# EAGLE design MaTouch Devkit_DC Driver V1.2 (EAGLE 6.1)
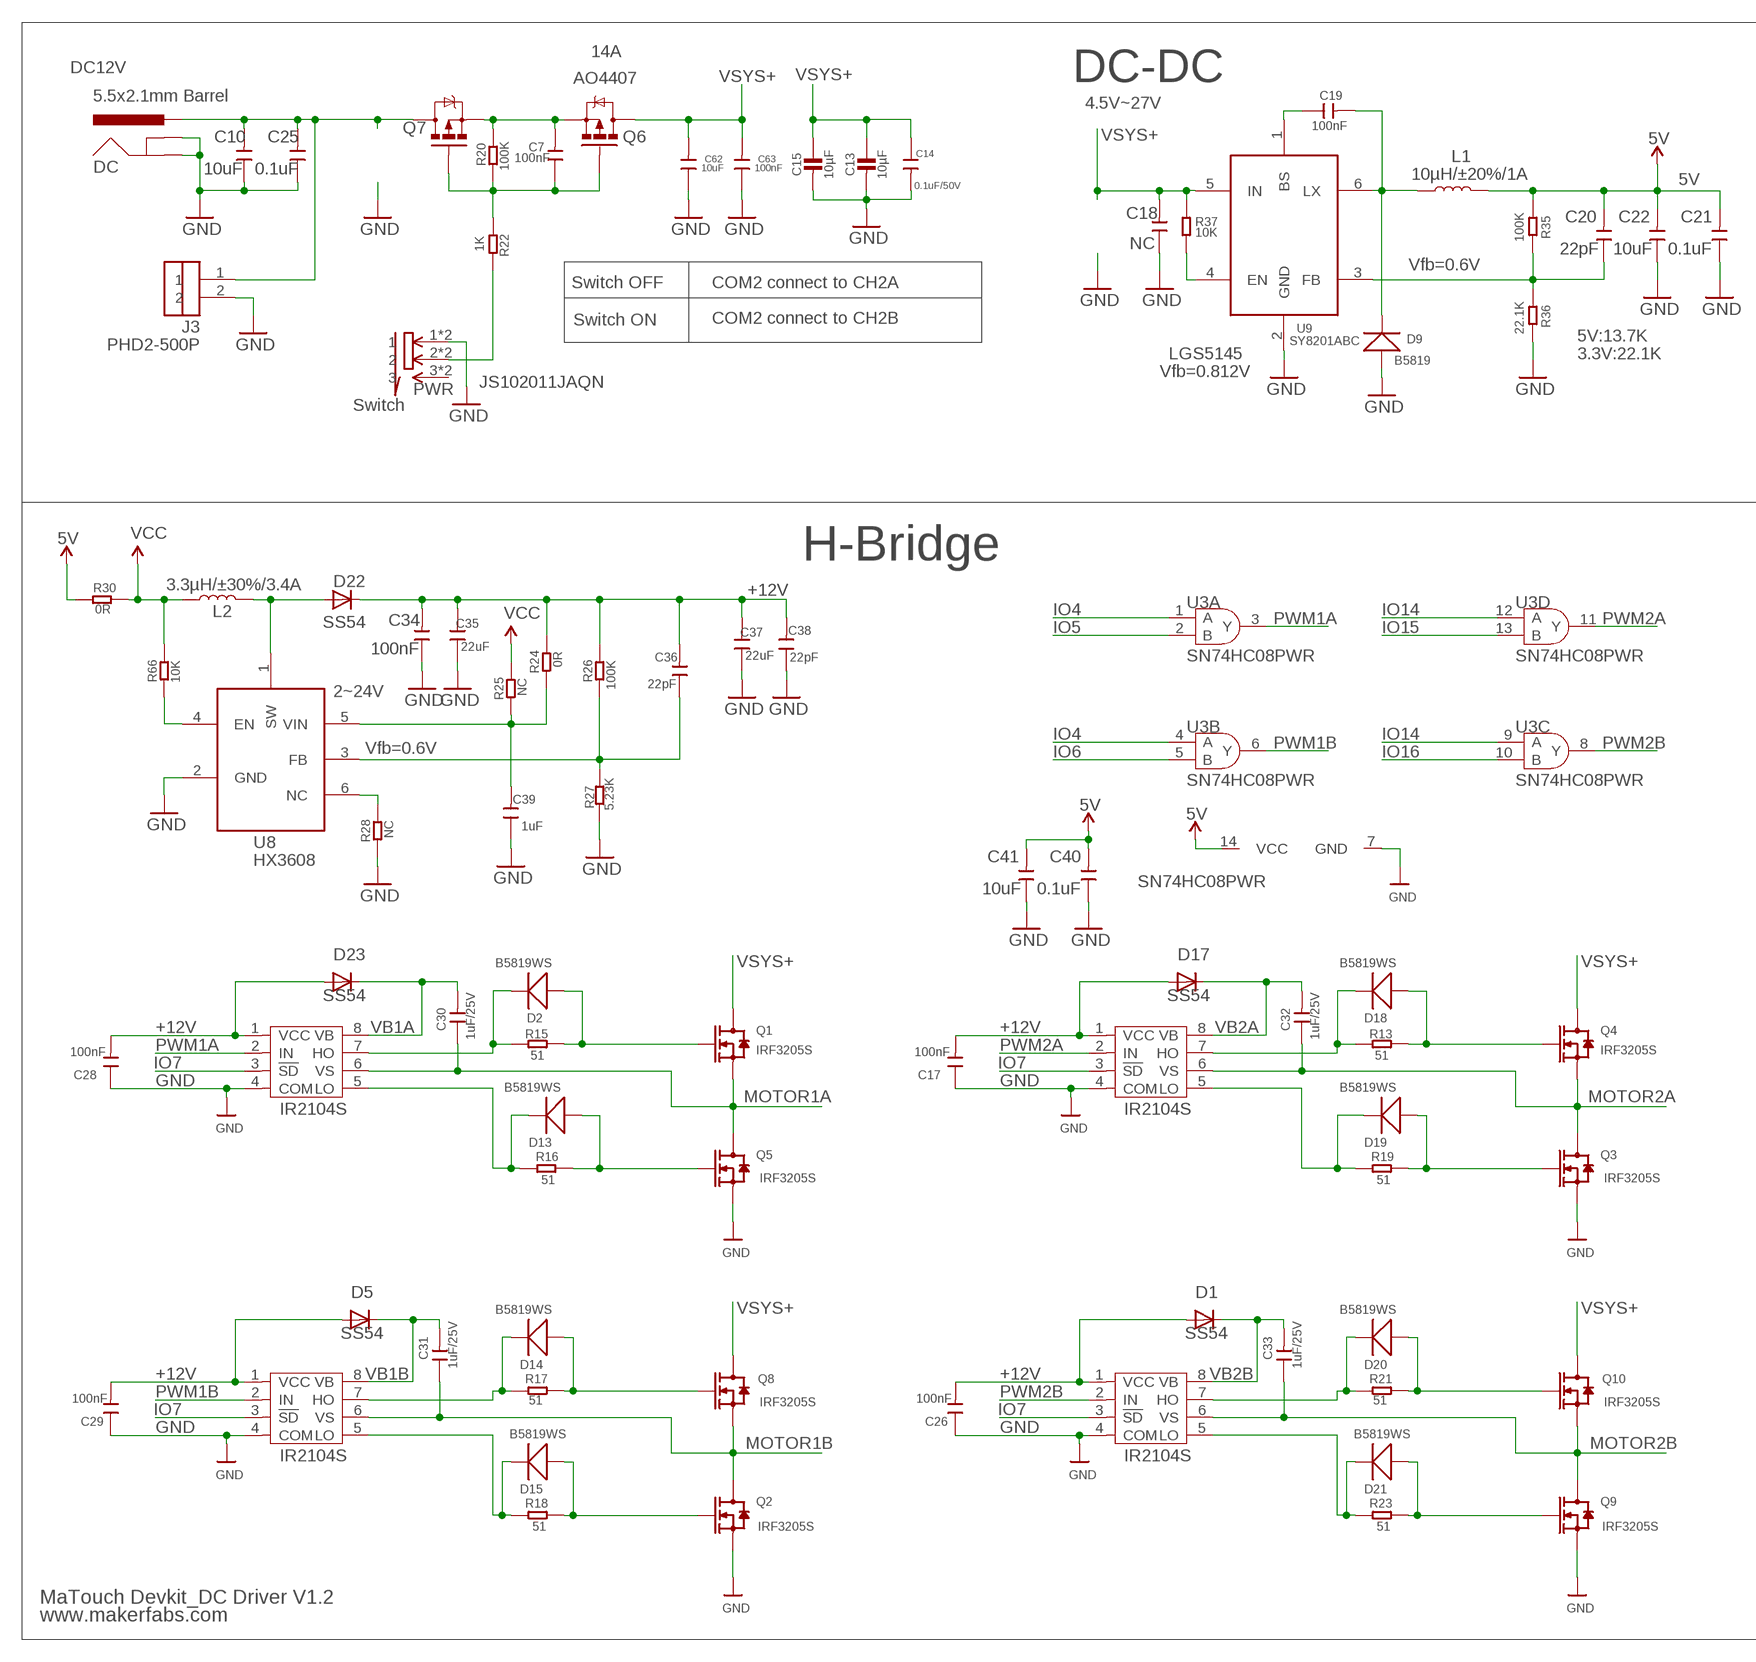
[diagram p0: schematic, sheet 1, part 1 of 2]
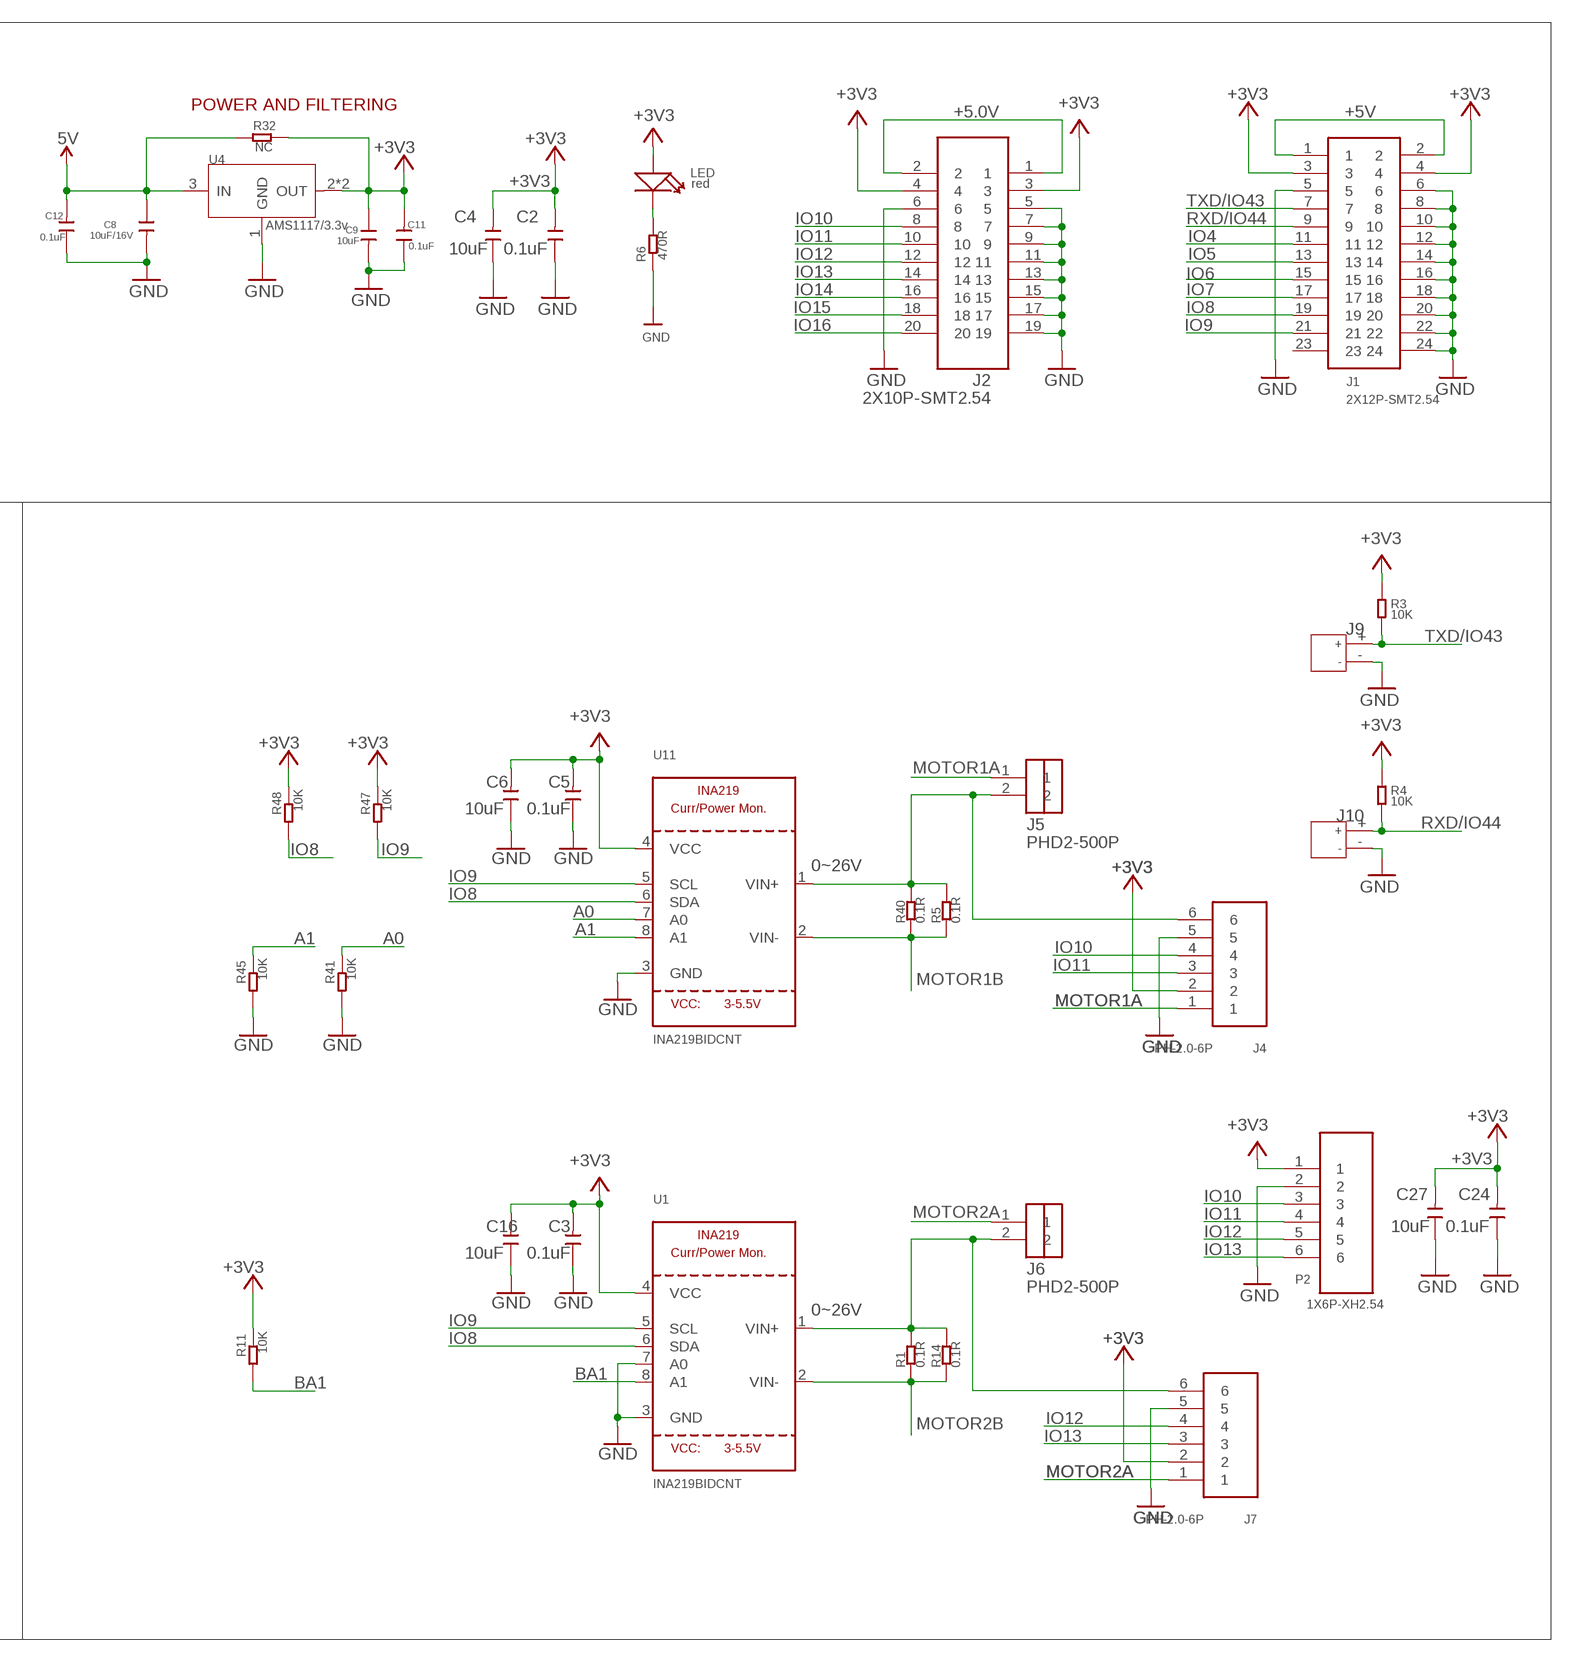
[diagram p1: schematic, sheet 1, part 2 of 2]

## Parts
C2  0.1uF  C-0603  [0603]
C3  0.1uF  C-0603  [0603]
C4  10uF  C-0603  [0603]
C5  0.1uF  C-0603  [0603]
C6  10uF  C-0603  [0603]
C7  100nF  C-0603  [0603]
C8  10uF/16V  C-0603  [0603]
C9  10uF  C-0603  [0603]
C10  10uF  C-0603  [0603]
C11  0.1uF  C-0603  [0603]
C12  0.1uF  C-0603  [0603]
C13  10µF  CAP_CERAMIC0805-NOOUTLINE  [0805-NO]
C14  0.1uF/50V  C-0603  [0603]
C15  10µF  CAP_CERAMIC0805-NOOUTLINE  [0805-NO]
C16  10uF  C-0603  [0603]
C17  100nF  C-0603  [0603]
C18  NC  C-0603  [0603]
C19  100nF  C-0603  [0603]
C20  22pF  C-0603  [0603]
C21  0.1uF  C-0603  [0603]
C22  10uF  C-0603  [0603]
C24  0.1uF  C-0603  [0603]
C25  0.1uF  C-0603  [0603]
C26  100nF  C-0603  [0603]
C27  10uF  C-0603  [0603]
C28  100nF  C-0603  [0603]
C29  100nF  C-0603  [0603]
C30  1uF/25V  C-0805  [0805]
C31  1uF/25V  C-0805  [0805]
C32  1uF/25V  C-0805  [0805]
C33  1uF/25V  C-0805  [0805]
C34  100nF  C-0603  [0603]
C35  22uF  DISCRETE_C-0805  [DISCRETE_C0805]
C36  22pF  C-0603  [0603]
C37  22uF  DISCRETE_C-0805  [DISCRETE_C0805]
C38  22pF  C-0603  [0603]
C39  1uF  C-0603  [0603]
C40  0.1uF  C-0603  [0603]
C41  10uF  C-0603  [0603]
C62  10uF  C-0603  [0603]
C63  100nF  C-0603  [0603]
D1  SS54  DIODE-DO-214AC  [DO-214AC]
D2  B5819WS  D'0805'  [SOD323]
D5  SS54  DIODE-DO-214AC  [DO-214AC]
D9  B5819  D'1206'  [SOD123]
D13  B5819WS  D'0805'  [SOD323]
D14  B5819WS  D'0805'  [SOD323]
D15  B5819WS  D'0805'  [SOD323]
D17  SS54  DIODE-DO-214AC  [DO-214AC]
D18  B5819WS  D'0805'  [SOD323]
D19  B5819WS  D'0805'  [SOD323]
D20  B5819WS  D'0805'  [SOD323]
D21  B5819WS  D'0805'  [SOD323]
D22  SS54  DIODE-DO-214AC  [DO-214AC]
D23  SS54  DIODE-DO-214AC  [DO-214AC]
DC  5.5x2.1mm Barrel  POWER_JACKSMD  [POWER_JACK_SMD]
J1  2X12P-SMT2.54  [2X12P-SMT2.54]
J2  2X10P-SMT2.54  [2X10P-SMT2.54]
J3  PHD2-500P  [OPL_EAGLE_LIBRARY_2P-5.0]
J4  PH-2.0-6P  [PH-2.0-6P]
J5  PHD2-500P  [OPL_EAGLE_LIBRARY_2P-5.0]
J6  PHD2-500P  [OPL_EAGLE_LIBRARY_2P-5.0]
J7  PH-2.0-6P  [PH-2.0-6P]
J9  JACK-JST-2P-PW'2.54/90D'  [JST-2P-2.54-90D]
J10  JACK-JST-2P-PW'2.54/90D'  [JST-2P-2.54-90D]
L1  10µH/±20%/1A  INDUCTOR-SRN6045-33UH  [SRN6045]
L2  3.3µH/±30%/3.4A  INDUCTOR-CR54-3.3UH  [CR54]
LED  red  DISCRETE_LED0603  [DISCRETE_LED-0603]
P2  1X6P-XH2.54  [1*6P-XH2.54]
PWR  JS102011JAQN  [SMD-6-2.5MM]
Q1  IRF3205S  MOSFET-N'IRF3205ZSPBF'  [TO263AB]
Q2  IRF3205S  MOSFET-N'IRF3205ZSPBF'  [TO263AB]
Q3  IRF3205S  MOSFET-N'IRF3205ZSPBF'  [TO263AB]
Q4  IRF3205S  MOSFET-N'IRF3205ZSPBF'  [TO263AB]
Q5  IRF3205S  MOSFET-N'IRF3205ZSPBF'  [TO263AB]
Q6  MOSFET-PCHANNELFDS6675  [SO08]
Q7  MOSFET-PCHANNELFDS6675  [SO08]
Q8  IRF3205S  MOSFET-N'IRF3205ZSPBF'  [TO263AB]
Q9  IRF3205S  MOSFET-N'IRF3205ZSPBF'  [TO263AB]
Q10  IRF3205S  MOSFET-N'IRF3205ZSPBF'  [TO263AB]
R1  0.1R  DISCRETE_R-2512  [DISCRETE_R2512]
R3  10K  R-0603  [R0603]
R4  10K  R-0603  [R0603]
R5  0.1R  DISCRETE_R-2512  [DISCRETE_R2512]
R6  470R  R-0603  [R0603]
R11  10K  R-0603  [R0603]
R13  51  R-0805  [R0805]
R14  0.1R  DISCRETE_R-2512  [DISCRETE_R2512]
R15  51  R-0805  [R0805]
R16  51  R-0805  [R0805]
R17  51  R-0805  [R0805]
R18  51  R-0805  [R0805]
R19  51  R-0805  [R0805]
R20  100K  R-0603  [R0603]
R21  51  R-0805  [R0805]
R22  1K  R-0603  [R0603]
R23  51  R-0805  [R0805]
R24  0R  R-0603  [R0603]
R25  NC  R-0603  [R0603]
R26  100K  R-0603  [R0603]
R27  5.23K  R-0603  [R0603]
R28  NC  R-0603  [R0603]
R30  0R  R-0603  [R0603]
R32  NC  R-0603  [R0603]
R35  100K  R-0603  [R0603]
R36  22.1K  R-0603  [R0603]
R37  10K  R-0603  [R0603]
R40  0.1R  DISCRETE_R-2512  [DISCRETE_R2512]
R41  10K  R-0603  [R0603]
R45  10K  R-0603  [R0603]
R47  10K  R-0603  [R0603]
R48  10K  R-0603  [R0603]
R66  10K  R-0603  [R0603]
U1  INA219BIDCNT  INA219  [SOT23-8]
U2  IR2104S  [SOIC-8]
U3  SN74HC08PWR  SN74HCT08PW  [TSSOP14]
U4  AMS1117/3.3v  LD1117'SOT89'  [SOT89]
U5  IR2104S  [SOIC-8]
U6  IR2104S  [SOIC-8]
U7  IR2104S  [SOIC-8]
U8  HX3608  [SOT-23-6]
U9  SY8201ABC  [SOT-23-6]
U11  INA219BIDCNT  INA219  [SOT23-8]

## Nets
5V: C8.1 C12.2 C20.2 C21.2 C22.2 C40.2 C41.2 L1.2 R30.1 R32.1 R35.1 U3.14(PWR:VCC) U4.3(IN)
+3V3: C2.2 C3.2 C4.2 C5.2 C6.2 C9.1 C11.2 C16.2 C24.2 C27.2 J1.3 J1.4 J2.3 J2.4 J4.2 J7.2 LED.+ P2.1 R3.1 R4.1 R11.2 R32.2 R47.2 R48.2 U1.4(VCC) U4.2(OUT) U4.4(OUT) U11.4(VCC)
+5.0V: J2.1 J2.2
+5V: J1.1 J1.2
+12V: C17.2 C26.2 C28.2 C29.2 C34.2 C35.2 C36.2 C37.2 C38.2 D1.A D5.A D17.A D22.C D23.A R24.2 R26.2 U2.1(VCC) U5.1(VCC) U6.1(VCC) U7.1(VCC)
A0: R41.2 U11.7(A0)
A1: R45.2 U11.8(A1)
BA1: R11.1 U1.8(A1)
ENABLE: R66.1 U8.4(EN)
GND: C2.1 C3.1 C4.1 C5.1 C6.1 C8.2 C9.2 C10.1 C11.1 C12.1 C13.2 C14.2 C15.2 C16.1 C17.1 C18.1 C21.1 C22.1 C24.1 C25.1 C26.1 C27.1 C28.1 C29.1 C34.1 C35.1 C37.1 C38.1 C39.1 C40.1 C41.1 C62.1 C63.1 D9.+ DC.GND(GNDBREAK) DC.P$4(GND) J1.5 J1.6 J1.8 J1.10 J1.12 J1.14 J1.16 J1.18 J1.20 J1.22 J1.24 J2.5 J2.6 J2.7 J2.9 J2.11 J2.13 J2.15 J2.17 J2.19 J3.2 J4.5 J7.5 J9.- J10.- P2.2 PWR.1 PWR.1@1 Q2.3(S) Q3.3(S) Q5.3(S) Q9.3(S) R6.1 R27.1 R28.1 R36.2 R41.1 R45.1 U1.3(GND) U1.7(A0) U2.4(COM) U3.7(PWR:GND) U4.1(GND) U5.4(COM) U6.4(COM) U7.4(COM) U8.2(GND) U9.2(GND) U11.3(GND)
IO4: J1.11 U3.1(A:A) U3.4(B:A)
IO5: J1.13 U3.2(A:B)
IO6: J1.15 U3.5(B:B)
IO7: J1.17 U2.3(!SD) U5.3(!SD) U6.3(!SD) U7.3(!SD)
IO8: J1.19 R48.1 U1.6(SDA) U11.6(SDA)
IO9: J1.21 R47.1 U1.5(SCL) U11.5(SCL)
IO10: J2.8 J4.4 P2.3
IO11: J2.10 J4.3 P2.4
IO12: J2.12 J7.4 P2.5
IO13: J2.14 J7.3 P2.6
IO14: J2.16 U3.9(C:A) U3.12(D:A)
IO15: J2.18 U3.13(D:B)
IO16: J2.20 U3.10(C:B)
MOTOR1A: C30.1 J4.1 J5.1 Q1.3(S) Q5.2(D) U6.6(VS)
MOTOR1B: C31.1 Q2.2(D) Q8.3(S) R5.1 R40.1 U7.6(VS) U11.2(VIN-)
MOTOR2A: C32.1 J6.1 J7.1 Q3.2(D) Q4.3(S) U2.6(VS)
MOTOR2B: C33.1 Q9.2(D) Q10.3(S) R1.1 R14.1 U1.2(VIN-) U5.6(VS)
N$1A: D18.- R13.1 U2.7(HO)
N$2: D19.- R19.1 U2.5(LO)
N$3: J6.2 J7.6 R1.2 R14.2 U1.1(VIN+)
N$4: D18.+ Q4.1(G) R13.2
N$5: LED.- R6.2
N$8: J4.6 J5.2 R5.2 R40.2 U11.1(VIN+)
N$9: C7.1 Q6.4(G) Q7.4(G) R20.2 R22.2
N$10: PWR.2 PWR.2@1 R22.1
N$11A: C10.2 C25.2 DC.VIN0(PWR) J3.1 Q7.5(D) Q7.6(D) Q7.7(D) Q7.8(D)
N$12: D19.+ Q3.1(G) R19.2
N$13: D20.- R21.1 U5.7(HO)
N$14: D2.- R15.1 U6.7(HO)
N$15: D13.- R16.1 U6.5(LO)
N$16: D2.+ Q1.1(G) R15.2
N$17: D13.+ Q5.1(G) R16.2
N$18: D14.- R17.1 U7.7(HO)
N$19: D15.- R18.1 U7.5(LO)
N$20: D14.+ Q8.1(G) R17.2
N$21: D15.+ Q2.1(G) R18.2
N$22: D21.- R23.1 U5.5(LO)
N$23: D20.+ Q10.1(G) R21.2
N$24: D21.+ Q9.1(G) R23.2
N$25: D22.A L2.P$2 U8.1(SW)
N$26: C39.2 R24.1 R25.1 U8.5(VIN)
N$27: C36.1 R26.1 R27.2 U8.3(FB)
N$28: R28.2 U8.6(NC)
N$41: C19.2 D9.- L1.1 U9.6(LX)
N$42: C19.1 U9.1(BS)
N$43: C20.1 R35.2 R36.1 U9.3(FB)
N$44: R37.2 U9.4(EN)
N$49: C7.2 Q6.1(S) Q6.2(S) Q6.3(S) Q7.1(S) Q7.2(S) Q7.3(S) R20.1
PWM1A: U3.3(A:Y) U6.2(IN)
PWM1B: U3.6(B:Y) U7.2(IN)
PWM2A: U2.2(IN) U3.11(D:Y)
PWM2B: U3.8(C:Y) U5.2(IN)
RXD/IO44: J1.9 J10.+ R4.2
TXD/IO43: J1.7 J9.+ R3.2
VB1A: C30.2 D23.C U6.8(VB)
VB1B: C31.2 D5.C U7.8(VB)
VB2A: C32.2 D17.C U2.8(VB)
VB2B: C33.2 D1.C U5.8(VB)
VCC: L2.P$1 R25.2 R30.2 R66.2
VSYS+: C13.1 C14.1 C15.1 C18.2 C62.2 C63.2 Q1.2(D) Q4.2(D) Q6.5(D) Q6.6(D) Q6.7(D) Q6.8(D) Q8.2(D) Q10.2(D) R37.1 U9.5(IN)
Unconnected: J1.23 PWR.3 PWR.3@1

## Notes on the sheet
- 14A
- DC12V
- AO4407 | DC-DC
- 4.5V~27V | POWER AND FILTERING
- Vfb=0.6V
- Switch OFF | COM2 connect to CH2A
- Switch ON | COM2 connect to CH2B
- 5V:13.7K
- LGS5145 | 3.3V:22.1K
- Vfb=0.812V
- Switch
- H-Bridge
- 2~24V
- Vfb=0.6V
- 0~26V
- 0~26V
- MaTouch Devkit_DC Driver V1.2
- www.makerfabs.com

## Library data of the parts
C2-C12 C14 C16-C22 C24-C34 C36 C38-C41 C62 C63 = Discrete:C*: Ceramic Capacitors
C13 C15 = microbuilder:CAP_CERAMIC: Ceramic Capacitors For new designs, use the packages preceded by an '_' character since they are more reliable: The following footprints should be used on most boards: _0402 - Standard footprint for regular board layouts _0603 - Standard footprint for regular board layouts _0805 - Standard footprint for regular board layouts _1206 - Standard footprint for regular board layouts For extremely tight-pitch boards where space is at a premium, the following 'micro-pitch' footprints can be used (smaller pads, no silkscreen outline, etc.): _0402MP - Micro-pitch footprint for very dense/compact boards _0603MP - Micro-pitch footprint for very dense/compact boards _0805MP - Micro-pitch footprint for very dense/compact boards _1206MP - Micro-pitch footprint for very dense/compact boards
C35 C37 = A9G:DISCRETE_C*: Ceramic Capacitors
D1 D5 D17 D22 D23 = diode:DIODE-: DIODE
D2 D9 D13-D15 D18-D21 = Discrete:D*
DC = SparkFun-Connectors:POWER_JACK: Power Jack Connector This is the standard 5.5mm barrel jack for power. The PTH is the most common, proven, reliable, footprint. The Slot footprint only works if the mill layer is transmitted to the PCB fab house so be warned. Here are the connectors we sell at SparkFun: DC Barrel Power Jack/Connector <https://www.sparkfun.com/products/119> (PRT-00119) DC Barrel Power Jack/Connector (SMD) <https://www.sparkfun.com/products/12748> (PRT-12748) DC Barrel Jack Adapter - Breadboard Compatible <https://www.sparkfun.com/products/10811> (PRT-10811) It is used on this SparkFun product (and many, many others): SparkFun RedBoard - Programmed with Arduino <https://www.sparkfun.com/products/12757> (DEV-12757) Also, if you need a mating power supply or connector, please check these out: Wall Adapter Power Supply - 9VDC 650mA <https://www.sparkfun.com/products/298> (TOL-00298) DC Barrel Jack Adapter - Male <https://www.sparkfun.com/products/10287> (PRT-10287); PROD_ID: CONN-08106; SF_ID: PRT-12748
J1 = sale:2X12P-SMT2.54
J2 = sale:2X10P-SMT2.54
J3 J5 J6 = COM-ZYPDN-SO:*PHD2-500P*
J4 J7 = Connector:PH-2.0-6P
J9 J10 = Connector:JACK-JST-2P-PW
L1 = SparkFun-Coils:INDUCTOR: Inductors Resist changes in electrical current. Basically a coil of wire. SparkFun Products: SparkFun Load Cell Amplifier - HX711 <https://www.sparkfun.com/products/13879> IOIO-OTG - V2.2 <https://www.sparkfun.com/products/13613>; PROD_ID: NDUC-11627; VALUE: 33µH/±20%/1.4A
L2 = SparkFun-Coils:INDUCTOR: Inductors Resist changes in electrical current. Basically a coil of wire. SparkFun Products: SparkFun Load Cell Amplifier - HX711 <https://www.sparkfun.com/products/13879> IOIO-OTG - V2.2 <https://www.sparkfun.com/products/13613>; PROD_ID: NDUC-11157
LED = A9G:DISCRETE_LED*
P2 = sale:1X6P-XH2.54
PWR = sale:JS102011JAQN
Q1-Q5 Q8-Q10 = template:MOSFET-N*: IRLL014: http://www.vishay.com/docs/91319/sihll014.pdf
Q6 Q7 = User-Submitted:MOSFET-PCHANNEL: Generic PMOSFET IRLML2244 - TRANS-11153 (SOT-23 -20V -4.3A) (1.Gate 2.Source 3.Drain) FQP27P06 - COM-10349 <http://www.sparkfun.com/products/10349> (TO-220 -60V -27A) (1.Gate 2.Source 3.Drain)
R1 R5 R14 R40 = A9G:DISCRETE_R*
R3 R4 R6 R11 R13 R15-R28 R30 R32 R35-R37 R41 R45 R47 R48 R66 = Discrete:R*
U1 U11 = microbuilder:INA219: INA219 - I2C Current/Power Monitor Voltage Range: 0-26V Accuracy: 0.5% Temperature: -40°C - 125°C
U2 U5-U7 = IC-dwin:IR2104S: HALF-BRIDGE DRIVER
U3 = template:SN74HCT08: Quadruple 2-Input Positive-AND Gates
U4 = IC:LD1117: Low Drop Fixed And Adjustable Positive Voltage Regulators http://www.datasheetcatalog.org/datasheet/SGSThomsonMicroelectronics/mXuqtqv.pdf
U8 = self:HX3608
U9 = self:SY8201ABC

## Net classes
0 default: width 0.203 mm, drill 0.305 mm, clearance 0.152 mm

## Board
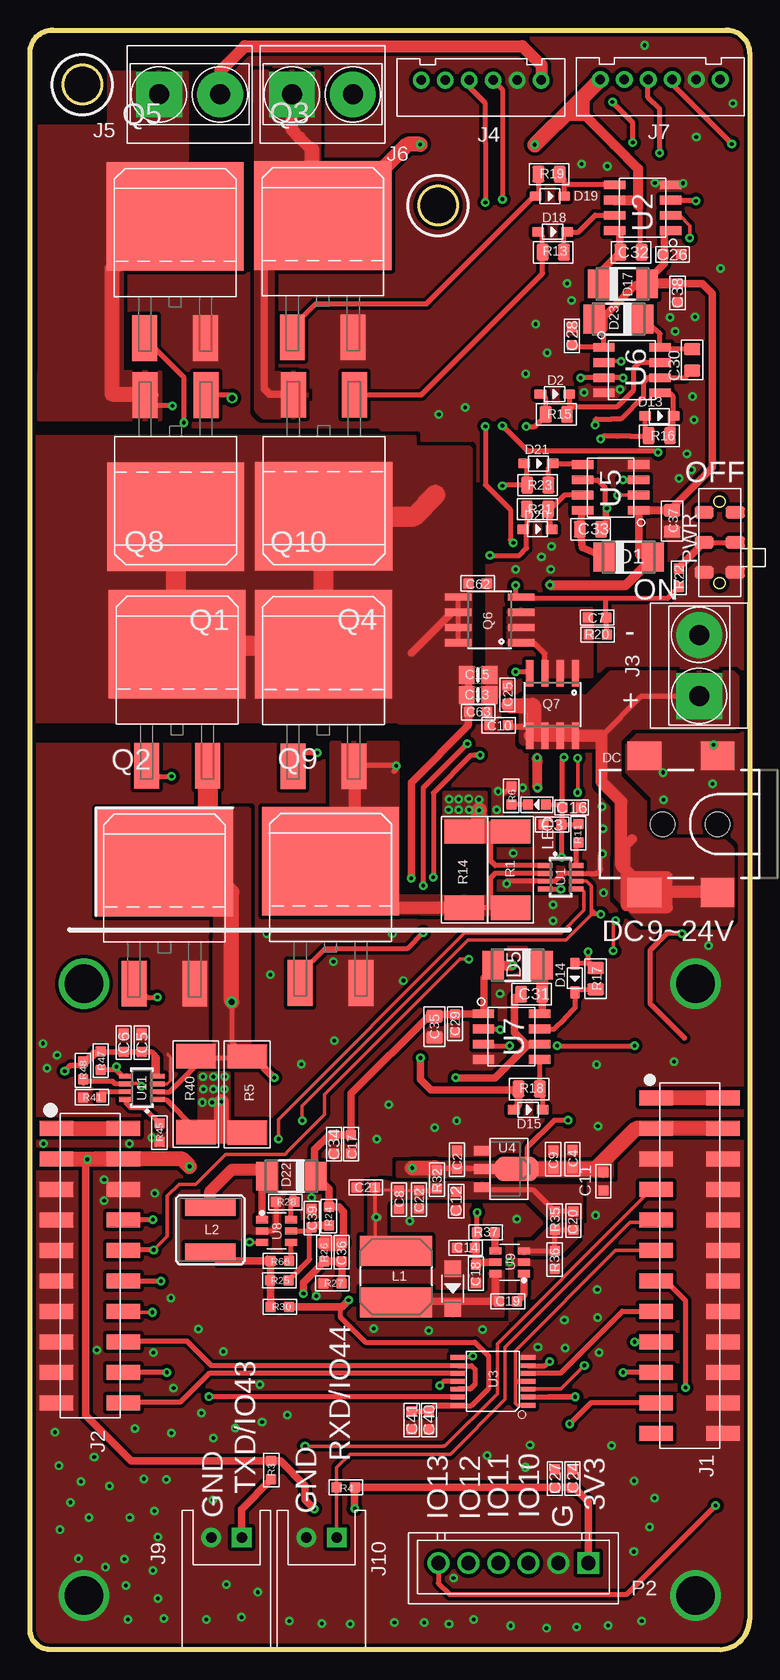
[diagram p2: board, top side]
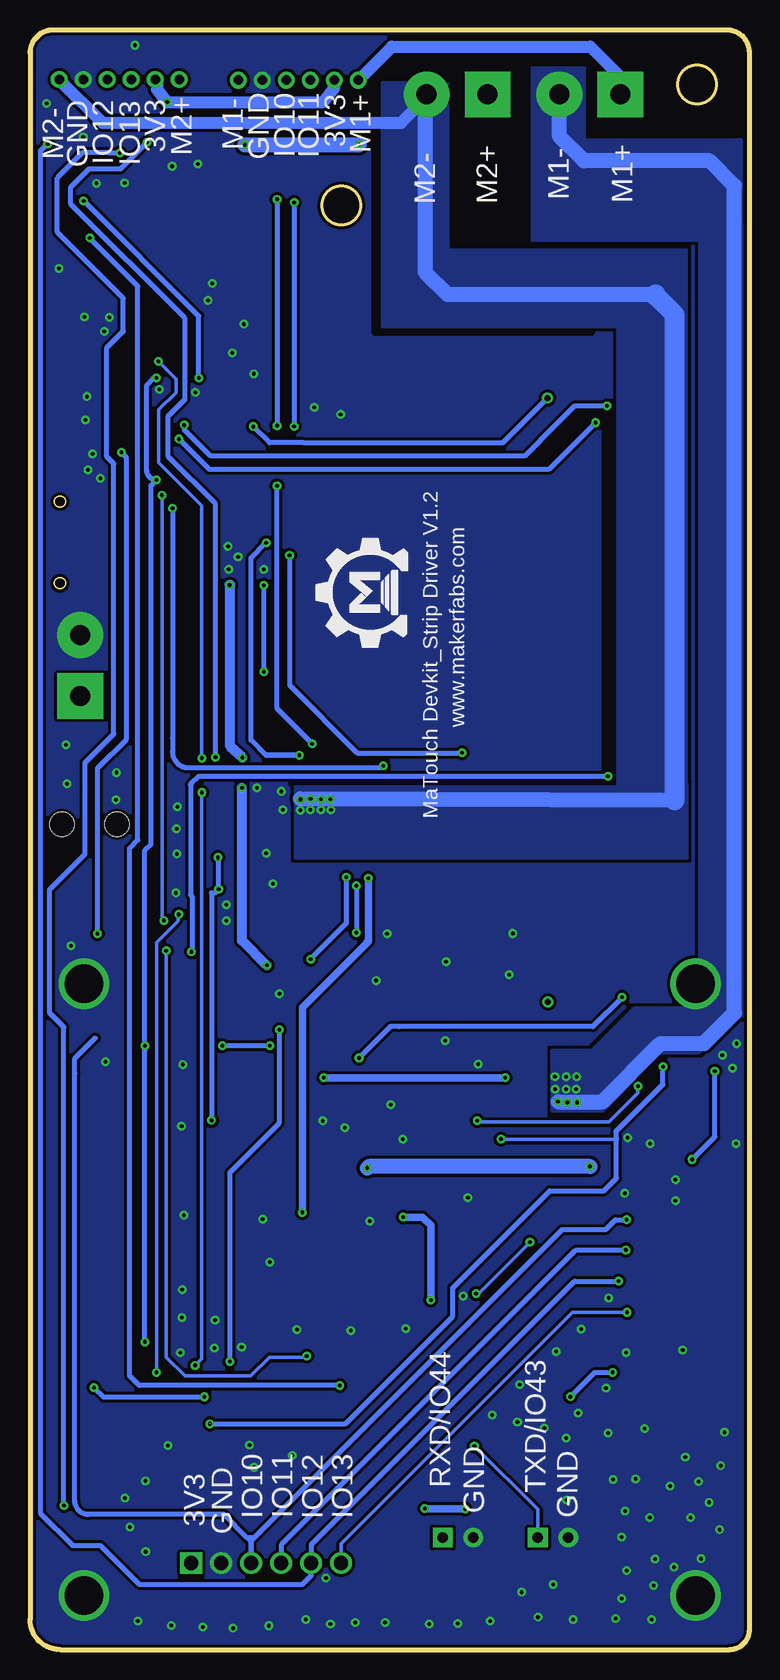
[diagram p3: board, bottom side, seen from below]

Size 60 x 135 mm. Coordinates in mm from the lower left corner, seen from the top.
Outline: 57.5,0 1.66,0 arc-90 0,1.66 0,133.09 arc-90 1.91,135 58.06,135 arc-90 60,133.06 60,2.5 arc-90 57.5,0
Outline: circle at 4.36,130.45 radius 1.6
Outline: circle at 34.02,120.37 radius 1.6
Copper layers (1*16): Top 0.035mm / dielectric 1.5mm / Bottom 0.035mm
Design rules: minimum track width 10mil, minimum drill 10mil, track to track 8mil, track to pad 8mil, pad to pad 8mil, via to via 8mil, smd to smd 0mil, copper to edge 10mil, drill to drill 8mil, minimum pad ring 10mil, minimum via ring 8mil, stop-mask expansion 4mil, vias tented up to drill 100mil, thermal gap 0mil
tRestrict: area 37.1,77.4 to 37.6,97; area 0.2,75.9 to 30.9,77; area 0.3,101.4 to 11.4,102.4; area 11,101.4 to 28.9,101.5
bRestrict: area 11.2,72.9 to 12.1,103; area 13.2,109.7 to 31.3,110; area 30.9,109.7 to 31.3,126.7; area 11.1,72.1 to 38.2,72.5

### Footprints (pad centres in the part's own frame; a part is rotated, then mirrored left to right if it is on the bottom)
0603 = smd 0.889 x 0.889: 1 -0.762,0; 2 0.762,0
0805-NO = smd 1.3 x 1.5: 1 -0.95,0; 2 0.95,0
0805 = smd 1.016 x 1.397: 1 -0.889,0; 2 0.889,0
DISCRETE_C0805 = smd 1.016 x 1.397: 1 -0.889,0; 2 0.889,0
DO-214AC = smd 1.8 x 2.4: A 2.025,0; C -2.025,0
SOD323 = smd 1 x 0.8: + -1.2,0; - 1.2,0
SOD123 = smd 1.397 x 1.397: + -1.651,0; - 1.651,0
POWER_JACK_SMD = smd 2.8 x 2.4: GND 0,-5.7; P$4 6.1,-5.7; VIN0 0,5.7; VIN1 6.1,5.7 | hole 2.032: 0,0; 4.572,0
2X12P-SMT2.54 = smd 1.27 x 2.8: 1 -13.97,-2.8; 2 -13.97,2.8; 3 -11.43,-2.8; 4 -11.43,2.8; 5 -8.89,-2.8; 6 -8.89,2.8; 7 -6.35,-2.8; 8 -6.35,2.8; 9 -3.81,-2.8; 10 -3.81,2.8; 11 -1.27,-2.8; 12 -1.27,2.8; 13 1.27,-2.8; 14 1.27,2.8; 15 3.81,-2.8; 16 3.81,2.8; 17 6.35,-2.8; 18 6.35,2.8; 19 8.89,-2.8; 20 8.89,2.8; 21 11.43,-2.8; 22 11.43,2.8; 23 13.97,-2.8; 24 13.97,2.8
2X10P-SMT2.54 = smd 1.27 x 2.8: 1 -11.43,-2.8; 2 -11.43,2.8; 3 -8.89,-2.8; 4 -8.89,2.8; 5 -6.35,-2.8; 6 -6.35,2.8; 7 -3.81,-2.8; 8 -3.81,2.8; 9 -1.27,-2.8; 10 -1.27,2.8; 11 1.27,-2.8; 12 1.27,2.8; 13 3.81,-2.8; 14 3.81,2.8; 15 6.35,-2.8; 16 6.35,2.8; 17 8.89,-2.8; 18 8.89,2.8; 19 11.43,-2.8; 20 11.43,2.8
OPL_EAGLE_LIBRARY_2P-5.0 = drill 1.668 pad 3.81 square: 1 -2.54,0 | drill 1.668 pad 3.81: 2 2.54,0
PH-2.0-6P = drill 0.8 pad 1.4: 1 -5,0; 2 -3,0; 3 -1,0; 4 1,0; 5 3,0; 6 5,0
JST-2P-2.54-90D = drill 0.889 pad 1.651 square: + 2.286,-1.27 | drill 0.889 pad 1.651: - 2.286,1.27
SRN6045 = smd 2.5 x 6: 1 -2.175,0; 2 2.125,0
CR54 = smd 4.2 x 1.4: P$1 0,1.85; P$2 0,-1.85
DISCRETE_LED-0603 = smd 0.889 x 0.889: + -0.762,0; - 0.762,0
1*6P-XH2.54 = drill 1.2 square: 1 -6.25,0 | drill 1.2: 2 -3.75,0; 3 -1.25,0; 4 1.25,0; 5 3.75,0; 6 6.25,0
SMD-6-2.5MM = smd 1 x 1.6: 1 -2.5,1.3; 1@1 -2.5,-1.3; 2 0,1.3; 2@1 0,-1.3; 3 2.5,1.3; 3@1 2.5,-1.3
TO263AB = smd 2.08 x 3.8: 1 -2.54,-6.4; 3 2.54,-6.4 | smd 11.43 x 9.05: 2 0,3.75
SO08 = smd 0.61 x 2.21: 1 -1.905,-2.616; 2 -0.635,-2.616; 3 0.635,-2.616; 4 1.905,-2.616; 5 1.905,2.616; 6 0.635,2.616; 7 -0.635,2.616; 8 -1.905,2.616
DISCRETE_R2512 = smd 2.032 x 3.302: 1 -3.175,0; 2 3.175,0
R0603 = smd 0.889 x 0.889: 1 -0.762,0; 2 0.762,0
R0805 = smd 1.016 x 1.397: 1 -0.889,0; 2 0.889,0
SOT23-8 = smd 0.4 x 1.2: 1 -0.975,-1.3; 2 -0.325,-1.3; 3 0.325,-1.3; 4 0.975,-1.3; 5 0.975,1.3; 6 0.325,1.3; 7 -0.325,1.3; 8 -0.975,1.3
SOIC-8 = smd 0.72 x 1.78: 1 -1.905,-2.34; 2 -0.635,-2.34; 3 0.635,-2.34; 4 1.905,-2.34; 5 1.905,2.34; 6 0.635,2.34; 7 -0.635,2.34; 8 -1.905,2.34
TSSOP14 = smd 0.4 x 1.2: 1 -2,-2.925; 2 -1.3,-2.925; 3 -0.65,-2.925; 4 0,-2.925; 5 0.65,-2.925; 6 1.3,-2.925; 7 2,-2.925; 8 2,2.925; 9 1.3,2.925; 10 0.65,2.925; 11 0,2.925; 12 -0.65,2.925; 13 -1.3,2.925; 14 -2,2.925
SOT89 = smd 0.8 x 1.4: 1 -1.524,-1.905; 3 1.524,-1.905 | smd 0.8 x 1.9: 2 0,-1.651 | smd 2.032 x 3.65: 4 0,0.94
SOT-23-6 = smd 1 x 0.6: 1 -1.2,0.95; 2 -1.2,0; 3 -1.2,-0.95; 4 1.2,-0.95; 5 1.2,0; 6 1.2,0.95

### Placement (x,y rotation side)
C2  35.61,40.84 270 top
C3  43.56,68.77 0 top
C4  45.24,40.89 270 top
C5  9.32,50.58 270 top
C6  7.82,50.58 270 top
C7  47.29,86.02 180 top
C8  30.78,37.5 270 top
C9  43.63,40.86 90 top
C10  39.09,77.05 0 top
C11  47.8,39.03 90 top
C12  35.53,37.37 90 top
C13  37.36,79.56 0 top
C14  36.35,33.49 180 top
C15  37.36,81.24 0 top
C16  45.16,70.19 180 top
C17  26.77,42.12 90 top
C18  37.18,31.32 90 top
C19  39.85,29.02 180 top
C20  45.31,35.76 90 top
C21  28.01,38.52 0 top
C22  32.43,37.51 90 top
C24  45.24,14.26 270 top
C25  39.8,79.58 270 top
C26  53.57,116.29 180 top
C27  43.76,14.26 270 top
C28  45.19,109.49 270 top
C29  35.43,52.18 90 top
C30  55.22,107.5 90 top
C31  41.83,54.62 0 top
C32  50.11,116.47 180 top
C33  46.74,93.38 180 top
C34  25.35,42.12 90 top
C35  33.73,51.9 90 top
C36  25.98,33.11 90 top
C37  53.54,94.07 90 top
C38  54,113.09 90 top
C39  23.5,35.95 270 top
C40  33.27,19.11 90 top
C41  31.83,19.11 90 top
C62  37.32,88.87 180 top
C63  37.36,78.13 180 top
D1  49.91,91.07 0 top
D2  43.76,104.63 0 top
D5  40.67,57.03 180 top
D9  35.25,30.09 270 top
D13  52.48,102.83 0 top
D14  45.44,55.97 270 top
D15  41.55,44.99 0 top
D17  49.43,113.83 0 top
D18  43.59,118.17 0 top
D19  43.36,121.14 0 top
D20  42.32,93.38 0 top
D21  42.39,98.87 0 top
D22  21.79,39.46 180 top
D23  49.07,110.91 180 top
DC  57.33,68.8 180 top
J1  55,32 270 top
J2  5,32 270 top
J3  PHD2-500P*  [OPL_EAGLE_LIBRARY_2P-5.0]  55.8,82.03 90 top
J4  37.62,130.82 0 top
J5  PHD2-500P*  [OPL_EAGLE_LIBRARY_2P-5.0]  13.31,129.63 0 top
J6  PHD2-500P*  [OPL_EAGLE_LIBRARY_2P-5.0]  24.38,129.63 0 top
J7  52.55,130.87 0 top
J9  16.38,7.05 90 top
J10  24.31,7.05 90 top
L1  30.53,31.12 90 top
L2  15.04,34.99 180 top
LED  42.27,70.42 180 top
P2  40.31,7.2 180 top
PWR  57.51,92.29 90 top
Q1  12.16,98.17 180 top
Q2  11.21,61.89 0 top
Q3  24.41,115.77 0 top
Q4  24.51,98.2 180 top
Q5  12.12,115.71 0 top
Q6  38.33,85.83 90 top
Q7  43.57,78.78 180 top
Q8  12.28,80.05 0 top
Q9  25.08,61.96 0 top
Q10  24.47,80.04 0 top
R1  40.08,65.01 90 top
R3  20.12,14.95 270 top
R4  26.34,13.52 180 top
R5  18.11,46.26 270 top
R6  40.13,71.18 270 top
R11  45.72,68.03 90 top
R13  43.64,116.47 180 top
R14  36.22,65.01 90 top
R15  43.89,102.96 180 top
R16  52.48,101.18 180 top
R17  47.17,55.92 90 top
R18  41.63,46.72 180 top
R19  43.28,122.97 180 top
R20  47.35,84.59 0 top
R21  42.32,95.06 180 top
R22  54.11,89.34 270 top
R23  42.34,97.06 180 top
R24  24.92,36.13 90 top
R25  20.8,30.77 180 top
R26  24.51,33.11 90 top
R27  25.22,30.52 0 top
R28  21.29,37.3 0 top
R30  20.83,28.56 180 top
R32  33.94,39.18 90 top
R35  43.75,35.75 270 top
R36  43.75,32.49 270 top
R37  38.02,34.77 0 top
R40  13.84,46.29 270 top
R41  5.18,46.04 0 top
R45  10.79,43.09 90 top
R47  5.89,49.08 90 top
R48  4.42,48.27 90 top
R66  20.83,32.4 180 top
U1  44.25,64.38 270 top
U2  51.08,120.18 90 top
U3  38.61,22.36 90 top
U4  39.63,40.06 270 top
U5  48.41,96.86 90 top
U6  50.19,106.64 270 top
U7  40.16,51.09 270 top
U8  20.57,34.89 0 top
U9  40,32.28 180 top
U11  9.32,46.82 90 top
U$2  [MAKERFABS_0.3]  28.57,84 90 bottom

### Tracks (layer width: path | path; a pad name or v marks a point on that pad's centre or on a via)
5V  (via drill 0.3)
  Top 0.254: 28.77,36.16 C21.2 28.77,36.03 28.77,34.31 29.82,33.26 30.52,33.26 L1.2 | 29.13,38.26 C8.1 32.42,38.26 C22.2
  Top 0.406: C20.2 R35.1 41.93,38.34 37.92,38.34 U4.3 | C22.2 33.8,38.27 R32.1 33.93,38.41 | U3.14 33.76,20.36 33.73,20.33 | C41.2 C40.2 33.73,20.33 | 33.73,20.33 36.8,20.33 38.25,21.78 38.25,24.45 37.08,25.62 27.96,25.62 25.88,27.7 25.88,28.51 25.93,28.56
  Top 0.61: R30.1 25.93,28.56 26.01,28.56 v26.57,29.12 | v28.88,36.03 28.91,36.03 28.93,36 28.98,36 29.01,36.03 28.77,36.03
  Bottom 0.61: v26.57,29.12 26.57,35.34 27.25,36.03 v28.88,36.03
  pour Top: 28.24,39 28.24,33.21 29.69,33.21 29.69,37.22 30.12,37.65 41.55,37.65 43.23,35.98 46.02,35.98 46.02,38.64 38.61,38.64 38.35,38.9 30.18,38.9 29.36,39.1 29.36,39
+3V3  (via drill 0.3)
  Top 0.305: 47.62,40.93 47.6,40.93 | 47.6,40.93 47.62,40.93 | 47.62,40.93 47.6,40.93 | 47.62,40.93 47.6,40.93 | 47.6,40.93 47.52,40.93 | 47.52,40.93 47.5,40.93 47.52,40.93 | 47.52,40.93 47.6,40.93
  Top 0.406: C9.1 43.66,40.13 C4.2 45.26,40.11 47.02,40.11 47.12,40.02 | U4.4 U4.2 35.63,40.06 C2.2 34.08,40.08 R32.2 33.71,40.17 | 7.85,49.85 R47.2 5.87,49.82 5.31,49.82 4.39,48.91 R48.2 4.37,48.7 3.38,48.7 3.16,48.49 | 9.88,49.85 10.13,49.85 10.31,49.67 | 10.31,49.67 10.62,49.36 U11.4 | v2.9,48.22 3.16,48.49 | 45.74,68.8 R11.2 45.7,68.77 C3.2 | C6.2 7.85,49.85 | 7.85,49.85 9.88,49.85 | 9.88,49.85 9.86,49.82 C5.2 | C27.2 43.79,13.47 45.26,13.47 C24.2 45.31,13.5 45.34,13.52 | v2.9,48.22 3.16,48.49 | v4.78,40.85 4.81,40.89 4.85,40.89 | 47.12,40.02 47.14,39.99 47.12,40.02 | C11.2 47.68,39.79 47.28,40.18 | 50.53,43.43 50.53,43.41 | 47.6,40.93 47.57,40.91 46.66,39.99 46.53,39.99 46.41,40.12 31.88,40.12 v31.88,40.14 | U1.4 44.11,63.4 44.26,63.4 v44.27,63.38 | v44.86,44.11 43.71,44.11 41.45,41.84 41.45,40.4 41.83,40.02 | C3.2 v44.32,66.03 | C3.2 44.4,68.77 C16.2 | C16.2 44.4,74.26 arc-90 v44.53,74.38 | 44.42,70.34 44.35,70.42 LED.+ 44.2,70.42 44.25,70.37 44.25,70.34 C16.2 | v2.9,48.22 2.9,48.25 3.38,48.73 4.24,48.73 4.39,48.88 4.52,49.01 4.55,49.01 4.6,49.06 4.9,49.06 5.59,49.75 5.64,49.75 5.69,49.8 10.19,49.8 10.31,49.67 | 10.31,49.67 10.31,48.04 10.39,47.97 10.41,47.97 10.49,48.04 | v50.27,125.61 50.27,127.29 v48.56,128.99
  Top 0.61: P2.1 46.56,8.73 46.56,12.3 45.34,13.52 R4.1 27.08,13.5 v27.08,11.75 | v23.7,11.72 22.94,12.48 22.94,13.65 20.88,15.71 R3.1 8.46,15.71 4.65,19.52 4.65,40.8 4.72,40.88 4.75,40.88 v4.78,40.85
  Top 1.27: J1.4 J1.3 50.53,43.43 47.28,40.18 47.12,40.02 41.83,40.02 40.61,40.02 U4.4 | v31.88,40.14 33.71,40.14 33.71,40.15 | 33.71,40.15 33.73,40.17 | 33.71,40.17 33.71,40.15 | J2.3 4.85,40.89 5.38,40.89 | 5.38,40.89 J2.4 | J2.4 7.92,40.89 arc-90 7.92,40.88 J2.4 arc-90 J2.4 | v13.31,40.27 12.69,40.89 5.38,40.89
  Bottom 0.406: v4.78,40.85 2.9,42.73 v2.9,48.22 | v44.86,44.11 44.86,63.08 44.6,63.08 44.27,63.41 | v44.53,74.38 44.53,95.52 48.46,99.45 48.46,102.83 47.07,104.23 47.07,110.96 56.59,120.48 56.59,121.91 55.07,123.43 52.45,123.43 v50.27,125.61 | v48.56,128.99 48.56,129.02 | 48.56,129.02 48.56,129.04 48.64,129.12 | 48.62,128.99 48.59,129.02 48.56,129.02 | v44.27,63.38 44.27,63.41 | 44.27,63.41 44.27,63.44 | 44.27,63.44 44.27,65.97 v44.32,66.03 | 44.27,63.41 44.27,63.44 | 44.27,63.44 44.27,63.41 | v44.32,66.03 44.3,66.03 v44.32,66.03 | v44.32,66.03 44.32,66 44.32,63.46 44.27,63.41
  Bottom 0.61: v23.7,11.72 27.05,11.72 v27.08,11.75
  Bottom 1.016: J7.2 49.4,130.72 49.4,130.03 48.62,128.99 v48.56,128.99 35.56,128.99 34.62,130.19 J4.2
  Bottom 1.27: v13.31,40.27 31.75,40.27 v31.88,40.14
  pour Top: 30.61,39.46 48.59,39.46 48.59,40.6 30.61,40.6
+5.0V
  Top 1.27: J2.1 J2.2
+5V
  Top 1.27: J1.2 J1.1
+12V  (via drill 0.3)
  Top 0.254: 52.96,118.27 52.98,118.25 53.45,118.25 | 53.45,118.25 53.85,118.25 | U2.1 53.45,118.25
  Top 0.305: C35.2 33.73,52.94
  Top 0.406: U2.1 53.65,118.27 | 37.19,53.04 37.24,53 37.26,53 U7.1 | 35.48,53 C29.2 | D23.A 47.85,110.11 U6.1 45.49,108.55 45.31,108.72 C28.2 | C26.2 52.86,116.24 52.86,116.04 52.91,115.99 | 23.29,40.02 23.31,40.03 D22.C | U5.1 50.91,95.11 53.47,95.11 | 38.63,56.78 D5.A | 24.97,42.89 C34.2 | 52.02,91.05 51.99,91.07 D1.A
  Top 0.61: U7.1 37.26,53 | 37.26,53 35.48,53 | 24.59,33.87 C36.2 26.16,34.05 26.16,36.49 25.76,36.89 R24.2 24.92,38.39 23.7,39.61 23.29,40.02 | 33.55,52.94 33.73,52.94 C29.2 | 47.85,110.11 47.85,111.11 50.52,113.78 51.4,113.78 D17.A 51.84,114.22 51.84,114.46 52.91,115.53 52.91,115.99 52.91,118.22 52.96,118.27 | C37.2 U5.1 50.75,91.24 D1.A | 53.47,95.11 56.9,98.54 56.9,113.02 56.06,113.85 C38.2 | 37.26,53 37.31,53.05 37.34,53.07 37.39,53.07 37.44,53.02 37.72,53.02 37.85,53.16 37.85,56 38.63,56.78 | D22.C 23.75,39.53 23.75,41.67 24.97,42.89 C34.2 C17.2 26.77,46.34 33.3,52.87 33.66,52.87 33.68,52.84 C35.2
  Top 0.813: C38.2 52.2,113.85 51.84,114.22 | D5.A v40.26,57.03 | v42.32,71.84 42.32,74.03 v42.29,74.35 | v43.36,88.73 49.71,88.73 52.02,91.05
  Top 1.016: 25.88,33.92 arc-90 25.91,33.95
  Top 1.27: R26.2 24.59,33.87 25.78,33.87 arc90 25.81,33.9 25.86,33.9 arc90 25.88,33.92
  Bottom 0.813: v40.26,57.03 42.32,59.09 v42.32,71.84 | v42.29,74.35 43.31,75.27 43.31,88.66 | 43.31,88.66 43.31,88.76 | 43.31,88.76 43.33,88.73 | 43.33,88.73 v43.36,88.73 | 43.33,88.73 43.31,88.76 | 43.31,88.76 43.33,88.76 43.31,88.73 43.31,88.66
A0
  Top 0.406: U11.7 5.97,46.5 R41.2
A1
  Top 0.406: R45.2 9.5,45.15 8.43,45.15 8.02,45.56 | 8.02,45.56 U11.8 8.02,45.56
BA1
  Top 0.406: U1.8 45.55,67.1 R11.1
ENABLE
  Top 0.406: R66.1 21.77,32.58 U8.4
GND  (via drill 0.3, 3.2)
  Top 0.254: U11.3 11.43,47.15 11.71,47.43 11.71,49.39 11.58,49.52 11.58,49.54 11.51,49.62
  Top 0.406: v39.75,63.83 39.75,64.05 U1.3 43.77,64.05 44.4,64.68 44.42,64.7 U1.7 47.19,64.7 arc90 47.57,65.09 47.57,66.14 arc-90 v47.75,66.32 | U8.2 20.27,34.89 20.57,35.19 20.57,37.58 20.55,37.6 R28.1 | v39.04,71.53 39.71,71.53 R6.1
  other vias: 42.17,110.49 8.75,18.41 14.72,2.49 3.38,12.27 5.57,24.97 4.04,7.57 5.36,16.05 44.79,113.87 15.25,12.47 47.25,48.77 54.77,99.67 22.62,48.79 19.35,18.96 11.8,18.03 47.36,43.64 43.07,1.78 50.37,14.06 45.58,1.88 40.09,1.98 48.2,2.01 34.1,102.94 55.5,4.5 20.03,56.26 38.11,16.18 41.69,17.04 48.5,16.99 30.39,2.26 32.88,2.26 34.94,2.13 36.99,2.49 47.46,24.74 25.31,57.33 4.5,4.5 44.61,25.12 44.56,27.46 17.11,18.46 41.31,15.19 28.92,42.54 21.63,2.39 11.16,2.59 40.6,35.86 31.66,35.71 16.37,5.41 10.68,9.37 2.5,9.98 2.4,15.31 4.91,11 4.25,13.99 18.99,4.77 6.29,6.86 52.08,12.62 51.68,10.21 8.01,5.33 10.25,6.58 58.61,128.88 51.24,133.73 31.14,55.76 24.35,2.16 17.64,2.69 51.02,2.36 26.71,2.13 10.65,4.24 7.89,7.54 39.99,32.28 8.17,2.49 10.38,11.56 53.72,49 55.37,102.49 36.3,103.53 19.73,59.69 30.22,59.66 55.5,55.5 2.26,49.53 53.81,109.88 53.38,111.05 49.21,105.03 45.15,112.44 55.46,111.07 41.34,106.35 43.12,108.1 57.59,115.14 46.01,123.82 55.56,126.08 48.15,123.65 56.92,72.16 35.58,44.07 40.31,66.37 54.13,97.61 55.24,104.44 55.17,98.32 15.28,17.63 23.48,37.67 23.89,29.46 47.18,36.19 47.31,30 25.36,50.75 33.74,43.51 29.91,45.41 42.35,25.22 37.73,26.67 28.66,26.74 33.26,26.59 10.3,24.74 16.12,24.84 11.98,21.79 19.16,22.07 9.49,14.22 11.37,14.17 21.45,19.53 14.29,19.71 2.07,18.11 8.32,11 6.62,13.61 10.4,38.02 14.03,26.72 1.08,50.52 1.41,48.46 11.75,29.31 47.33,27.66 50.36,8.15 41.07,71.83 38.91,70 43.48,91.97 43.43,90.04 42.65,91.08 40.51,90.04 47.7,70.26 47.78,68.43 47.83,63.07 6.18,39.17 6.18,37.41 10.17,42.67 1.13,42.16 8.29,42.16 46.21,104.8 43.64,62.08 43.64,60.76 39.19,54.66 52.81,73.1 57,75.41 54.44,122.22 52.11,122.25 35.32,5.97 52.83,70.84 56.57,58.67
  pour Bottom (isolate 0.254, rank 4): -1.2,-15.8 -1.2,145 80,145 80,-15.8
  pour Top (isolate 0.305, rank 4, no thermals): -0.6,-15.8 -0.6,165 80,165 80,-15.8
IO4
  Top 0.305: U3.1 40.63,20.36 40.46,20.53 40.46,22.08 | 40.46,22.08 40.46,22.11 40.72,22.36 U3.4 | U3.4 41.55,22.36 U3.4 | J1.11 48.83,33.27 40.46,24.9 40.46,22.08 | 40.46,22.08 40.46,22.39 40.49,22.41 41.48,22.41 41.55,22.34
IO5  (via drill 0.3)
  Top 0.406: J1.13 52.2,30.41 53.29,30.41 53.34,30.41 54.66,29.09 v54.66,21.83 | U3.2 43.26,21.06 | 43.26,21.06 v45.47,21.06 | v45.47,21.06 45.47,21.04 | v45.47,21.06 43.26,21.06
  Bottom 0.406: v54.66,21.83 53.87,21.04 45.47,21.04 v45.47,21.06
IO6
  Top 0.406: U3.5 41.54,23.02 44.22,23.02 49.39,28.19 J1.15
IO7  (via drill 0.3)
  Top 0.406: v45.92,106.01 U6.3 v49.45,106.01 | v55.52,120.76 53.47,120.76 U2.3 | J1.17 v50.43,25.65 v50.42,25.64 | v49.45,97.5 U5.3 | U7.3 37.94,50.33 v40,50.33 | v43.97,50.33 v50.42,50.33
  Bottom 0.406: v45.92,106.01 45.92,111.16 v55.52,120.76 | v50.42,25.64 50.42,49.9 | 50.42,49.9 v50.42,50.33 | v50.42,50.33 50.42,66.64 49.91,67.14 49.91,97.04 v49.45,97.5 arc90 50.27,98.31 50.27,105.37 49.63,106.01 v49.45,106.01 | v40,50.33 v43.97,50.33 | v50.42,50.33 50.42,49.9
IO8  (via drill 0.3)
  Top 0.305: U1.6 46.4,64.05 46.81,63.64 46.81,62.62 | v9.28,46.95 9.12,47.18 8.03,47.18 8.02,47.17 U11.6 | 46.81,62.6 46.81,62.62 | 46.81,61.28 46.76,61.22 44.68,59.14 42.34,59.14 36.52,59.14 22.71,45.33 v22.71,44.08 | 46.81,61.28 46.81,61.73 | 46.81,61.73 46.81,62.62 | v47.6,61.28 47.27,61.28 | 47.27,61.28 46.81,61.28 | 46.81,61.73 47.27,61.28
  Top 0.406: U11.6 7.09,47.15 6.88,47.36 4.57,47.36 4.47,47.26 4.47,47.15 R48.1 | J1.19 v49.45,23.11 v49.45,23.1
  Bottom 0.305: v9.28,46.95 9.32,46.39 11.73,43.98 22.61,43.98 v22.71,44.08 | v49.45,23.1 49.45,58.61 49.45,58.94 47.65,60.74 47.65,61.22 v47.6,61.28
IO9  (via drill 0.3)  (1 unrouted)
  Top 0.305: U1.5 45.59,63.36 46.02,63.36 46.2,63.18 46.2,61.63 44.3,59.73 36.25,59.73 20.73,44.21 v20.73,42.56
  Top 0.406: U11.5 8.04,47.81 | 7.21,48.27 7.16,48.32 R47.1 | v7.21,48.58 7.21,48.27 | 7.21,48.27 7.67,47.81 8.04,47.81 | 8.1,47.81 8.04,47.81 | J1.21 46.77,20.57 v45.01,18.81
  Bottom 0.305: v20.73,42.56 20.73,42.51 11.1,42.51
  Bottom 0.406: 11.12,43.19 11.1,43.17 11.1,42.63 11.1,42.51 11.1,39.28 12.14,38.24 16.66,38.24 24.74,30.16 24.74,27.77 33.68,18.83 45,18.83 | 11.12,43.17 11.12,43.19 | 11.12,43.19 7.21,47.1 v7.21,48.58 | v45.01,18.81 45.01,18.83
IO10  (via drill 0.3)  (1 unrouted)
  Top 0.406: v10.24,35.83 7.8,35.83 J2.8 arc90 J2.8 | J4.4 39.4,130.04 v39.4,120.89 | v39.4,102.02 41.48,99.94 50.55,99.94 52.12,99.94 v52.38,99.78 | v54.38,59.68 53.09,59.68 51.69,58.28 51.69,53.83 54.59,50.94
  Bottom 0.406: 41.3,9.33 41.56,9.07 P2.3 | 41.3,9.33 16.56,34.07 15.62,35.01 11.99,35.01 11.18,35.83 v10.24,35.83 | P2.3 | P2.3 41.56,9 41.55,9 41.88,9.33 | 41.88,9.33 43.81,11.26 55.14,11.26 arc90 56.26,12.38 56.26,47.99 56.26,49.26 54.59,50.94 | v39.4,120.89 v39.4,102.02 | 54.59,50.94 54.56,50.96 54.59,50.94 | v52.38,99.78 51.99,99.4 51.99,75.83 54.38,73.44 v54.38,59.68 | 41.3,9.33 41.88,9.33
IO11  (via drill 0.3)
  Top 0.305: v36.6,57.54 35.84,57.54 24.56,46.27 24.56,44.59 21.57,41.59 21.26,41.29 16.31,41.29 13.79,38.77 12.42,38.77 11.46,37.81 11.46,34.43 10.29,33.26 10.29,33.28 v10.31,33.31
  Top 0.406: v10.31,33.31 7.84,33.31 arc90 J2.10 | v37.97,120.64 37.97,125.64 37.97,128.89 36.6,130.26 36.62,130.28 J4.3 | v37.97,101.97 37.97,97.09 40.06,95.01 40.06,92.49 40.31,92.24 v40.31,92.26 | v33.63,64.38 33.63,71.41 36.78,74.56 37.03,74.56 | 37.03,74.56 v37.53,74.56 | v37.53,74.56 v37.54,74.56 | v37.54,74.56 v37.53,74.56 | v37.54,74.56 v37.53,74.56 | v37.54,74.56 v37.53,74.56 | v37.54,74.56 v37.53,74.56 | v37.53,74.56 37.03,74.56 | v37.54,74.56 v37.53,74.56 | v37.54,74.56 v37.53,74.56
  Bottom 0.406: v10.31,33.31 14.47,33.31 16.68,31.1 39.06,8.72 P2.4 39.06,7.15 P2.4 39.09,7.2 | v37.97,120.64 v37.97,101.97 | v33.63,64.38 33.63,60.51 v36.6,57.54 | v40.31,92.26 41.58,90.99 41.58,75.81 40.34,74.56 | 40.34,74.56 38.53,74.56 37.82,74.56 | 37.82,74.56 v37.54,74.56 37.82,74.56 | 37.82,74.56 40.34,74.56 | v37.53,74.56 37.82,74.56
IO12  (via drill 0.3)
  Top 0.406: v10.92,30.7 7.83,30.7 arc-90 J2.12 | J7.4 53.55,130.48 v58.52,125.51
  Bottom 0.406: v10.92,30.7 14.59,30.7 16.57,28.71 36.55,8.73 36.56,8.72 P2.5 36.56,7.22 36.55,7.23 36.55,6.16 37.26,5.45 37.26,5.47 37.29,5.45 50.9,5.45 54.13,8.67 56.44,8.67 59.13,11.36 59.13,71.97 59.13,124.9 v58.52,125.51
IO13  (via drill 0.3)
  Top 0.305: v10.21,28.1 7.87,28.1 arc-90 J2.14 arc90 J2.14
  Top 0.406: v52.5,124.75 52.5,128.41 51.54,129.37 51.54,130.75 51.61,130.82 51.6,130.82 J7.3 | P2.6 34.06,5.52 35,4.58 49.76,4.58 v57.17,12
  Bottom 0.305: 34.06,7.23 34.06,8.83 16.64,26.25 14.78,28.1 v10.21,28.1
  Bottom 0.406: v57.17,12 57.17,51.88 58.37,53.07 58.37,63.33 55.4,66.31 55.4,73.24 55.4,73.92 53.01,76.31 53.01,98.84 53.59,99.43 53.59,108.52 52.22,109.89 52.22,112.64 52.32,112.74 52.3,112.74 57.71,118.15 57.71,122.64 57.71,122.67 55.63,124.75 53.42,124.75 v52.5,124.75 | 34.06,7.23 P2.6
IO14
  Top 0.406: U3.12 35.7,21.73 36.73,21.73 37.11,22.11 37.11,23.38 36.83,23.66 U3.9 15.13,23.66 13.11,25.69 7.84,25.69 J2.16
IO15  (via drill 0.3)
  Top 0.406: U3.13 v14.94,21.06 v14.94,21.07 | v11.4,23.1 v11.39,23.11 J2.18
  Bottom 0.406: v14.94,21.07 12.9,23.1 v11.4,23.1
IO16
  Top 0.406: U3.10 14.93,23.01 12.52,20.61 7.77,20.61 | 7.77,20.61 7.75,20.59 | J2.20 7.77,20.6 7.77,20.61
MOTOR1A  (via drill 0.3)
  Top 0.406: 55.19,106.64 C30.1 54.61,106.01 U6.6 51.56,106.01 51.16,105.6 51.16,104.48 49.25,102.58 48.51,102.58 47.22,102.58 47.14,102.5 v47.14,102.07 | 10.53,104.57 10.49,104.57 | 10.49,104.57 Q1.3 9.63,104.61 | v11.89,103.67 10.36,103.67 arc-90 9.88,104.15 10.08,104.15 arc90 10.49,104.56 10.49,104.57
  Top 1.27: Q5.2 11.22,119.46 6.83,115.07 6.83,104.69 6.86,104.66 9.58,104.66 9.63,104.61
  Bottom 0.406: v11.89,103.67 14.55,103.67 16.18,102.04 18.69,99.53 45,99.53 47.14,101.67 v47.14,102.07
  Bottom 1.016: J4.1 29.82,133.62 13.28,133.62 10.77,131.1 J5.1 10.77,129.47
  pour Top: 6.63,131.46 13.03,131.46 13.03,121.04 6.63,121.04
  pour Top: 10.87,102.6 10.87,106.44 0.76,106.44 0.76,102.6
  pour Top: 0.71,126.99 0.71,102.6 7.75,102.6 7.75,126.99
MOTOR1B  (via drill 0.3, 0.5)
  Top 0.305: 40.41,54.34 40.69,54.62 C31.1
  Top 0.406: U11.2 11.66,46.5 13.99,48.83 13.99,49.31 | 13.99,49.31 R40.1 | 13.99,49.31 17.98,49.31 R5.1 | v16.82,53.99 16.82,50.61 18.06,49.36 18.11,49.41 R5.1 | 18.31,49.47 18.29,49.44 R5.1
  Top 0.61: 40.41,54.34 40.41,51.42 40.59,51.24 41.43,50.41 41.73,50.41 | U7.6 42.45,50.41 41.73,50.41 | 41.73,50.41 41.5,50.41 38.76,47.66 v35.51,47.66 | v20.37,47.66 18.57,49.47 18.31,49.47
  Top 1.27: v16.82,53.99 16.82,63.16 14.45,65.52
  Top 1.676: Q8.3 14.82,65.81 14.45,65.44 13.64,65.44 13.54,65.54 12.93,65.54 12.84,65.64 Q2.2
  Bottom 0.61: v35.51,47.66 v20.37,47.66
  pour Top: 18.26,49.57 18.26,70.01 15.42,70.01 15.39,48.65 18.24,48.65
MOTOR2A  (via drill 0.3)
  Top 0.406: C32.1 50.95,116.39 50.9,116.44 50.9,120.18 50.29,120.79 48.77,120.79 | 48.77,120.79 U2.6 48.77,120.79 | 50.7,121.35 50.7,121.14 50.34,120.79
  Top 0.61: Q4.3 21.93,104.63 19.99,104.63 19.51,105.12 19.51,106.97 19.51,118.35 20.95,118.35 20.95,120.44 23.5,120.44
  Top 0.813: Q3.2 24.41,119.57 | 50.34,120.79 48.77,120.79 | 50.7,120.36 50.7,121.35 50.7,123.46 48.72,125.44 45.42,128.74 45.41,128.74 45.64,128.74 46.28,129.37 46.28,127.88 44.73,127.88
  Top 1.016: 23.5,125.03 22.49,126.03 | 22.49,126.03 21.84,126.68 J6.1 | 22.48,126.02 22.49,126.03
  Top 1.27: 23.5,125.03 23.5,120.44 Q3.2 24.71,119.82 25.86,119.82 31.5,125.46 v32.54,125.46 | J7.1 45.42,128.74 42.12,125.44 v42.09,125.44
  Bottom 1.27: v42.09,125.44 32.56,125.44 v32.54,125.46
  pour Top: 18.85,131.53 24,131.51 24.1,120.99 18.95,121.02
  pour Top: 18.87,115.76 18.87,103.36 19.46,102.78 22.81,102.78 23.06,103.03 23.06,106.36 20.22,106.36 20.22,115.76
MOTOR2B  (via drill 0.3)
  Top 0.406: U1.2 38.78,64.7 38.41,64.32 38.41,62.14 | 38.41,62.14 38.53,62.01 | R1.1 37.82,61.81 37.77,61.86 | 37.77,61.86 38.12,61.86 38.41,62.14 | 37.77,61.86 38.2,61.86 38.28,61.94 | U5.6 47.35,97.5 47.93,96.91 47.93,93.23 C33.1 48.11,93.41 v48.11,95.13 | 27.05,73.57 27.01,73.61 Q10.3 arc-90 27.08,73.57 27.08,73.44 arc90 27.36,73.16 27.38,73.16 27.38,73.67 v30.53,73.67 arc-90 30.33,73.19
  Top 1.016: 27.05,73.57 27.05,67.69 Q9.2 26.58,65.71 30.43,61.86 R14.1
  Bottom 0.406: v48.11,95.13 48.11,75.98 48.11,74.81 arc-98 46.61,73.52 arc17 46.58,73.52 30.45,73.52 arc90 30.53,73.59 v30.53,73.67
  pour Top: 25.2,75.58 30.61,75.58 30.61,68.85 25.2,68.85
  pour Top: 39.52,61.28 29.06,61.38 29.01,62.83 39.55,62.75
N$1A
  Top 0.406: R13.1 44.53,117.91 D18.- 44.79,118.15 44.78,118.15 45.72,118.15 47.14,119.57 48.71,119.57 U2.7
N$2
  Top 0.406: D19.- 44.56,122.08 | 44.56,122.08 44.56,122.59 R19.1 | U2.5 44.56,122.08
N$3  (via drill 0.3)
  Top 0.406: U1.1 38.8,65.35 38.43,65.72 38.43,68.41 R1.2
  Top 1.27: 38.43,68.41 38.02,68.01 38.02,67.78 37.44,68.36 37.44,69.96 37.44,69.99 v37.47,69.96 | v37.47,69.96 37.47,69.94 v37.47,69.96
  Bottom 1.016: J7.6 53.95,127.26 29.06,127.26 26.9,129.42 26.9,129.65 J6.2
  Bottom 1.27: 37.47,70.93 6.25,70.8 | J6.2 27.05,129.5 27.05,114.82 25.2,112.97 7.82,112.97 7.75,112.97 7.72,112.94
  Bottom 1.676: 6.25,70.8 6.25,111.26 7.82,112.84 7.82,112.97
  other vias: 36.63,69.99 37.44,70.85 35.76,70.88 34.95,70.88 34.9,70.01 36.6,70.9 35.76,70.01
  pour Bottom: 25.12,130.59 30.66,130.59 30.66,111.92 25.12,111.92
  pour Bottom: 30.66,110.27 5.23,110.22 5.23,116.65 30.66,116.7
  pour Bottom: 11,70.19 11,116.65 5.28,116.65 5.28,70.19
  pour Bottom: 5.2,72.17 37.9,72.17 37.9,66 5.2,66
  pour Top: 34.5,71.46 38.02,71.46 38.02,68.44 34.5,68.44
N$4
  Top 0.406: D18.+ 42.75,117.81 R13.2 42.77,116.44 42.75,116.42 42.75,114.69 32.66,104.6 Q4.1
N$5
  Top 0.406: LED.- R6.2
N$8  (via drill 0.3, 3.2)
  Top 0.406: U11.1 11.34,45.85 13.69,43.5 | 13.69,43.5 13.84,43.34 R40.2 | 13.79,43.17 R40.2 | R40.2 13.92,43.04 | 13.69,43.5 15.98,43.5 | 42.65,130.69 42.62,130.72 J4.6
  Top 1.016: J5.2 15.88,129.65 15.88,131.61 17.93,133.67 41.05,133.67 42.65,132.07 42.65,130.69
  Top 1.27: 13.79,43.17 14.1,43.47 16.99,43.47 16.99,43.5 17.4,43.09 R5.2 | 15.98,43.5 v15.98,45.66
  Top 1.676: 13.92,43.04 18.01,43.04 18.11,43.14
  Bottom 1.27: v15.98,45.66 12.27,45.66 7.42,50.51 3.81,50.51 1.27,53.05 1.27,122.03 3.33,124.09 13.82,124.09 15.85,126.12 J5.2
  other vias: 4.5,55.5 16.23,47.74 14.43,47.74 15.29,47.74 14.45,46.7 15.29,46.7 16.21,46.7 14.38,45.6 15.19,45.6
  pour Bottom: 1.12,125.82 18.16,125.82 18.16,117.46 0.66,117.46 0.66,125.84 1.17,125.84
  pour Bottom: 0.61,118.78 4.19,118.78 4.19,117.49 4.19,52.79 0.58,52.79 0.58,118.81
  pour Bottom: 13.77,131.86 13.77,124.73 18.11,124.73 18.11,131.86
  pour Bottom: 10.54,50 10.54,46.57 12.24,44.87 16.46,44.87 16.46,49.95 16.46,49.97 16.46,50
  pour Top: 16.64,43.22 16.64,48.04 14.07,48.04 14.07,43.22
  pour Bottom: 0.66,53.43 9.58,53.38 13.18,49.77 4.27,49.82
  pour Bottom: 8.64,50.76 8.64,49.31 11.07,46.87 11.07,50.76
  pour Bottom: 9.02,50.41 9.02,48.32 11.66,48.32 11.66,50.41
N$9  (via drill 0.3)
  Top 0.406: R20.2 C7.1 48.01,86.07 48.01,87.62 | Q7.4 41.57,81.5 v40.49,81.5 | v40.49,88.71 40.49,87.74 40.87,87.74 41.02,87.74 | 41.22,87.74 41.02,87.74 | R22.2 53.15,87.62 48.01,87.62 | 48.01,87.62 42.01,87.62 41.9,87.73 Q6.4 40.95,87.74 41.02,87.74
  Bottom 0.406: v40.49,81.5 v40.49,88.71
N$10
  Top 0.406: 56.31,92.29 PWR.2 56.31,92.29 | 56.31,92.29 58.73,92.29 58.78,92.24 58.78,92.26 PWR.2@1 | 54.15,90.13 54.13,90.11 R22.1
  Top 0.61: PWR.2 54.18,90.26 54.18,90.16 54.15,90.13 54.03,90.13
N$11A
  Top 0.406: Q7.5 Q7.6 | Q7.6 43.97,76.16 | 43.97,76.16 Q7.7 | Q7.7 Q7.8 | Q7.8 47.68,76.16 50.98,79.46 55.78,79.46 J3.1 | Q7.8 Q7.7 | Q7.7 44.2,76.16 | Q7.7 43.97,76.16 | 43.97,76.16 Q7.6 | C10.2 45.21,76.72 45.34,76.85 41.91,76.85 39.8,76.85 39.9,76.85 39.93,76.82 | 39.93,78.69 C25.2
  Top 0.813: 50.22,67.55 49.71,67.04 49.71,61.96 50.29,61.96 50.29,61.89 50.27,61.89
  Top 1.016: 50.27,64.38 50.27,63.16 | 50.27,63.16 50.27,61.89 50.29,61.89 53.11,61.89 53.11,64.38 50.27,64.38 | 50.27,64.38 49.33,65.31 49.33,70.67 47.68,72.33 47.68,76.19 47.65,76.16 Q7.5 | DC.VIN0 57.73,63.16 50.32,63.16 50.27,63.16
  Top 1.27: 39.93,78.69 41.92,78.69 41.99,78.62 41.99,76.92 41.91,76.85
  pour Top: 41.4,79.44 46.48,79.44 48.49,81.44 58.57,81.44 58.95,81.06 58.95,77.08 58.72,76.85 50.14,76.85 48.51,75.22 41.43,75.22 41,75.65 41,79.03
  pour Top: 52.55,67.02 51.28,68.29 51.28,70.57 49.15,72.71 49.15,76.97 47.37,76.97 47.37,72.2 48.9,70.67 48.9,65.37 52.55,65.37
  pour Top: 50.52,67.45 48.84,65.77 48.84,62.8 51.1,60.54 58.06,60.54 58.55,61.02 58.55,66.71 57.81,67.45
N$12
  Top 0.406: R19.2 42.39,121.32 42.19,121.12 42.18,121.12 D19.+ | Q3.1 21.88,110.25 23.8,112.18 33.07,112.18 42.06,121.17 42.09,121.14 D19.+ | D19.+
N$13
  Top 0.406: U5.7 44.55,96.23 43.28,94.96 43.28,93.62 D20.- 43.48,93.38 43.41,93.46 43.41,94.86 R21.1
N$14
  Top 0.406: U6.7 50.8,107.28 50.29,106.77 50.29,104.94 48.92,103.57 46.92,103.57 45.36,103.57 arc90 44.91,103.11 44.78,102.98 R15.1 arc90 44.96,103.14 D2.-
N$15
  Top 0.406: U6.5 53.34,104.74 53.59,104.48 53.59,102.81 53.62,102.78 53.62,101.13 R16.1 53.39,102.55 D13.-
N$16  (via drill 0.3, 0.5)
  Top 0.406: v16.84,104.33 16.6,104.57 Q1.1 | D2.+ arc-90 43,104.2 R15.2 43.05,102.91 43.05,102.88 42.11,101.94 v41.38,101.94
  Bottom 0.406: v16.84,104.33 20.57,100.59 37.19,100.59 40.03,100.59 v41.38,101.94
N$17  (via drill 0.3)
  Top 0.406: D13.+ 51.28,101.24 R16.2 51.59,100.93 51.59,101.2 51.54,101.15 51.56,101.13 50.09,101.13 48.95,101.13 47.8,101.13 v47.57,100.9 | Q5.1 12.83,106.06 v12.83,102.27
  Bottom 0.406: v12.83,102.27 16.74,98.36 45.03,98.36 46.2,99.53 v47.57,100.9
N$18
  Top 0.406: U7.7 43.69,51.73 44.63,52.67 45.47,53.5 45.47,54.77 D14.- | D14.- | D14.- 45.7,55.03 R17.1
N$19
  Top 0.406: 42.52,49.24 R18.1 42.75,46.49 D15.- | 42.52,49.24 42.49,49.26 | 42.52,49.24 42.5,49.21 U7.5
N$20  (via drill 0.3)
  Top 0.406: R17.2 46.81,57.17 D14.+ 45.47,57.17 45.47,57.16 45.49,57.16 45.49,57.19 46.51,57.19 46.51,57.16 46.53,57.16 v46.53,58.15 | Q8.1 9.74,73.53 10.49,72.78 v11.81,72.78
  Bottom 0.406: v11.81,72.78 45.82,72.78 45.95,72.78 46.58,72.15 | 46.48,62.75 46.48,58.2 v46.53,58.15 | 46.58,72.15 46.63,72.1 | 46.63,62.9 46.53,62.8 | 46.53,62.8 46.48,62.75 | 46.48,62.75 46.48,62.78 | 46.48,62.78 46.51,62.8 | 46.48,62.75 46.48,62.78 | 46.48,62.78 46.51,62.78 46.53,62.8 | 46.53,62.8 46.51,62.8 | 46.51,62.8 46.56,62.85 46.56,72.12 46.58,72.15
N$21  (via drill 0.3)
  Top 0.406: R18.2 40.35,46.34 40.35,46.41 40.51,46.57 40.44,46.65 | Q2.1 9.79,54.37 v10.62,54.37
  Top 0.61: D15.+ 40.74,45.38 R18.2 | 40.44,46.65 33.45,46.65 32.56,47.53 v32.56,49.31
  Bottom 0.406: v10.62,54.37 13.06,51.93 29.21,51.93 29.95,51.93 v32.56,49.31
N$22
  Top 0.406: R23.1 43.23,98.51 D21.- 45.72,98.87 45.82,98.77 U5.5 | U5.5 46.1,98.77 U5.5
N$23  (via drill 0.3)
  Top 0.406: R21.2 41.43,93.69 D20.+ | D20.+ 41.07,93.38 41.05,93.38 | v38.35,91.2 40.8,91.2 41.4,91.81 41.4,93.23 41.2,93.43 41.17,93.43 D20.+ | v23.95,74.74 22.71,74.74 arc90 22.17,74.2 22.17,73.82 arc-90 22,73.65 Q10.1 arc90 Q10.1
  Bottom 0.406: v38.35,91.2 38.35,80.38 32.72,74.74 v23.95,74.74
N$24  (via drill 0.3)
  Top 0.406: D21.+ 41.45,98.61 R23.2 40.06,97.06 39.45,97.06 39.37,96.99 | v36.47,75.5 32.79,71.82 v32.79,63.66 | v32.79,59.75 31.45,58.41 24.59,58.41 22.54,56.35 Q9.1 | 39.37,96.99 39.37,97.01 39.37,96.99 | v39.4,97 39.38,97 39.37,96.99
  Bottom 0.406: v32.79,63.66 v32.79,59.75 | v36.47,75.5 39.4,78.42 v39.4,97 | v39.4,97 39.4,97.04 v39.4,97
N$25
  Top 0.61: U8.1 19.37,39.48 | 19.37,39.48 19.37,39.93 D22.A | 19.28,40.02 19.28,39.58 19.37,39.48
  Top 1.016: L2.P$2 15.04,38.19 16.87,40.02 19.28,40.02 19.3,40.04
N$26
  Top 0.406: U8.5 21.8,34.91 23.32,34.91 | 23.32,34.91 23.7,35.29 | R25.1 23.32,32.52 23.32,34.91
  Top 0.61: R24.1 23.62,35.37 23.55,35.29 | 23.7,35.29 23.55,35.29 | 23.55,35.29 C39.2
N$27  (via drill 0.3)
  Top 0.305: U8.3 18.32,33.94 v18.31,33.95
  Top 0.61: R27.2 25.98,31.02 26.01,31.05 26.01,32.32 C36.1 R26.1 24.56,32.4 24.59,32.4 22.81,30.62 v22.81,29.68
  Bottom 0.305: v18.31,33.95 22.58,29.68 v22.81,29.68
N$28
  Top 0.406: U8.6 21.77,37.46 21.87,37.55
  Top 0.61: 21.87,37.55 22.02,37.55 22.05,37.58 22.02,37.58 R28.2
N$41
  Top 0.61: 35.2,29.02 C19.2 38.8,29.31 U9.6 | 35.2,29.02 30.6,29.02 L1.1 | D9.- 35.26,28.97 35.2,29.02
  pour Top: 27.66,27.82 39.47,27.82 39.47,31.53 38.28,31.53 38.28,29.96 37.9,29.58 27.66,29.58
N$42
  Top 0.61: C19.1 41.2,29.6 U9.1
N$43
  Top 0.406: U9.3 43.74,33.23 R36.1 R35.2 C20.1
  pour Top: 40.72,32.96 44.25,32.96 45.8,34.5 45.8,35.44 43.54,35.44 42.04,33.95 40.72,33.95
N$44
  Top 0.406: 38.79,34.86 38.78,34.85 R37.2
  Top 0.61: U9.4 38.79,33.25 38.79,34.86
N$49
  Top 0.406: 40.98,86.5 Q6.3 | Q7.3 42.94,82.98 41.99,83.93 40.95,83.93 Q6.1
  pour Top: 39.85,86.75 46.84,86.75 46.84,81.11 42.8,81.11 42.8,82.41 42.8,83.78 39.93,83.78 arc-90 39.85,83.86
PWM1A  (via drill 0.3)
  Top 0.305: U3.3 44.26,21.71 v46.23,23.68 | v45.67,71.44 v45.67,74.31 | v49.3,107.38 48.01,107.38 47.88,107.25 U6.2
  Bottom 0.305: v46.23,23.68 45.67,24.24 v45.67,71.44 | v45.67,74.31 45.67,95.34 49.28,98.94 49.28,103.34 47.83,104.79 47.83,105.9 v49.3,107.38
PWM1B  (via drill 0.3)
  Top 0.406: U3.6 42.93,23.66 v43.33,23.99 | v39.22,51.67 37.87,51.67 U7.2
  Bottom 0.406: v43.33,23.99 43.33,39.76 39.19,43.9 39.19,51.65 v39.22,51.67
PWM2A  (via drill 0.3)
  Top 0.305: v55.02,117.65 55.02,118.71 54.18,119.54 U2.2
  Top 0.406: U3.11 34.52,22.36 v34.16,22.01 | 53.44,119.52 U2.2 53.47,119.5 53.47,119.49 | 53.52,119.44 53.47,119.49 | 53.47,119.49 53.47,119.47
  Bottom 0.406: v34.16,22.01 50.88,22.01 51.69,22.82 51.69,66.79 51,67.47 51,113.64 v55.02,117.65
PWM2B  (via drill 0.3)
  Top 0.305: 50.77,96.23 U5.2 v49,96.23 | U3.8 36.95,24.36 v36.93,24.47 | v48.64,58.25 48.64,60.56 v48.84,60.77
  Bottom 0.305: v48.64,58.25 48.64,24.37 47.07,22.8 41.6,22.8 40.03,24.37 37.03,24.37 v36.93,24.47 | v48.84,60.77 49,61.12 v49,96.23
RXD/IO44  (1 unrouted)
  Top 0.305: 25.58,9.31 R4.2 25.58,15.18 26.67,16.27 35.05,16.27 39.62,20.84 39.62,25.21 50.04,35.62 51.05,35.62 | 50.65,35.62 51.05,35.62 | 51.05,35.62 51.09,35.66 | 51.09,35.66 51.24,35.81 J1.9 | 51.05,35.62 51.09,35.66
TXD/IO43  (via drill 0.3)
  Top 0.305: v22.94,16.95 34.47,16.95 34.49,16.98 34.62,16.98 38.96,21.32 38.96,25.49 49.81,36.33 51.83,38.35 J1.7
  Top 0.61: R3.2 17.63,11.7 17.63,9.31 J9.+
  Bottom 0.305: v22.94,16.95 17.65,11.67 J9.+ 17.65,9.31
VB1A
  Top 0.406: C30.2 52.63,108.39 52.5,108.52 52.5,109.68 | 52.5,109.68 D23.C 51.1,111.07 51.16,111.01 51.16,110.88 51.18,110.86 | U6.8 52.53,109.65 52.5,109.68
VB1B
  Top 0.406: 41.99,56.77 D5.C
  Top 0.61: C31.2 42.72,53.22 U7.8
  Top 1.016: C31.2 42.72,56.73 42.67,56.78 42.67,57.02 D5.C
VB2A
  Top 0.406: U2.8 48.79,118.27 48.84,118.22 49.33,118.22 49.35,118.2 | 49.35,116.65 49.28,116.57
  Top 0.61: D17.C 47.4,114.65 C32.2 49.28,116.52 49.28,116.57 | 49.35,116.65 49.35,116.67 49.2,116.83 49.2,118.27 U2.8
VB2B
  Top 0.61: D1.C 46.08,91.86 C33.2 U5.8
VCC
  Top 0.406: R25.2 20.07,30.8 R66.2 19.81,32.65 | 15.47,32.65 15.04,33.08 L2.P$1
  Top 0.61: 15.47,32.65 15.72,32.4 R66.2 R30.2
VSYS+  (via drill 0.3)
  Top 0.406: Q6.8 Q6.7 Q6.6 Q6.5 | 37.18,32.57 37.19,32.58 37.19,33.41 C14.1 | R37.1 37.29,34.77 v37.29,36.44 | C15.1 36.44,81.27 36.58,81.27
  Top 0.61: R37.1 37.18,34.7 37.18,32.57 | 37.18,32.57 C18.2 | U9.5 37.47,32.28 arc-90 37.18,32.57 | 31.8,83.07 35.18,86.45 | v31.8,64.3 31.8,72.27 36.58,77.05 36.58,81.27 36.58,81.34
  Top 1.676: Q1.2 12.16,83.87 12.34,83.68 24.41,83.68 24.49,83.75 24.49,94.37 24.56,94.45 24.56,94.55 24.79,94.78 | Q4.2 32.01,94.45 33.81,96.25
  Bottom 0.61: v37.29,36.44 37.29,53.51 31.8,59 31.84,59 31.88,58.97 31.77,59.07 31.77,64.32 v31.8,64.3
  pour Top: 0.41,101.05 32.03,101.05 32.03,77.38 0.41,77.38
  pour Top: 30.89,100 36.5,100 36.5,77.48 30.89,77.48

### Text on the board
tPlace: OFF | ON | - | + | DC | 9~24V | RXD/IO44 | TXD/IO43 | GND | GND | IO13 | IO12 | IO11 | IO10 | G | 3V3
bPlace: M1+ | 3V3 | IO11 | IO10 | GND | 3V3 | IO13 | IO12 | GND | M1- | M2+ | M2- | M1+ | M1- | M2+ | M2- | www.makerfabs.com | MaTouch Devkit_Strip Driver V1.2 | RXD/IO44 | TXD/IO43 | GND | GND | IO13 | IO12 | IO11 | IO10 | GND | 3V3